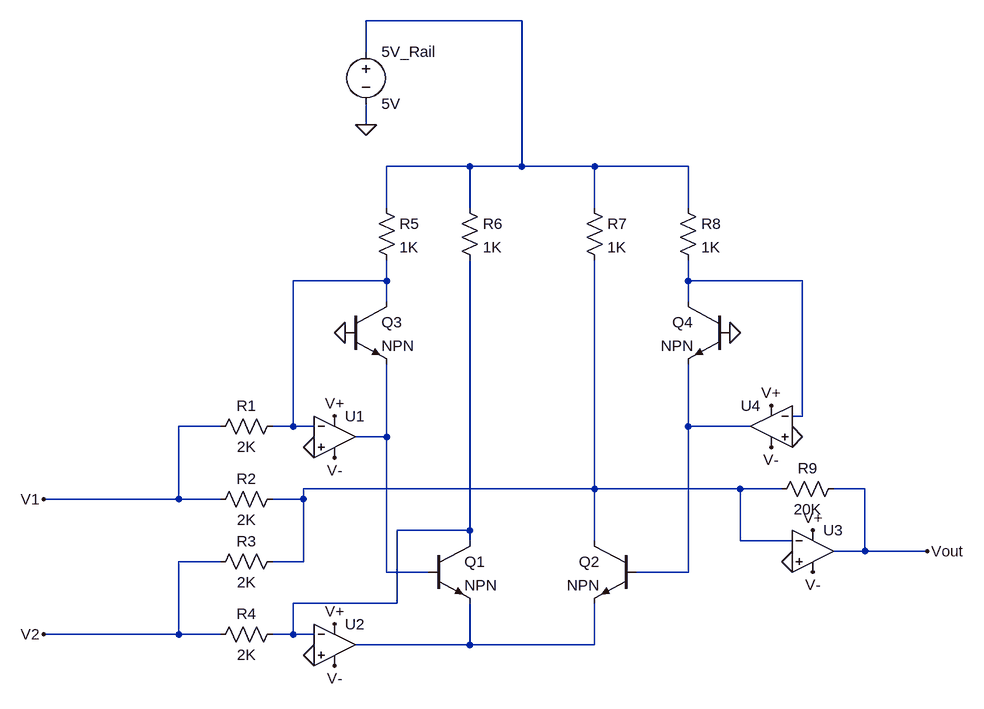
[diagram p0: schematic 4_Quadrant_Multiplier.asc]
4_Quadrant_Multiplier.asc, the LTspice schematic file:
Version 4.1
SHEET 1 1144 680
WIRE 448 -544 208 -544
WIRE 208 -496 208 -544
WIRE 208 -384 208 -416
WIRE 368 -320 240 -320
WIRE 448 -320 448 -544
WIRE 448 -320 368 -320
WIRE 560 -320 448 -320
WIRE 704 -320 560 -320
WIRE 240 -256 240 -320
WIRE 368 -256 368 -320
WIRE 560 -256 560 -320
WIRE 704 -256 704 -320
WIRE 240 -144 240 -176
WIRE 240 -144 96 -144
WIRE 704 -144 704 -176
WIRE 880 -144 704 -144
WIRE 240 -112 240 -144
WIRE 704 -112 704 -144
WIRE 880 64 880 -144
WIRE 880 64 864 64
WIRE -16 80 -80 80
WIRE 96 80 96 -144
WIRE 96 80 64 80
WIRE 128 80 96 80
WIRE 704 80 704 -16
WIRE 800 80 704 80
WIRE 240 96 240 -16
WIRE 240 96 192 96
WIRE 560 176 560 -176
WIRE 560 176 112 176
WIRE 784 176 560 176
WIRE 848 176 784 176
WIRE 976 176 928 176
WIRE -80 192 -80 80
WIRE -80 192 -288 192
WIRE -16 192 -80 192
WIRE 112 192 112 176
WIRE 112 192 64 192
WIRE 368 240 368 -176
WIRE 368 240 256 240
WIRE 368 256 368 240
WIRE 560 256 560 176
WIRE 784 256 784 176
WIRE 864 256 784 256
WIRE 976 272 976 176
WIRE 976 272 928 272
WIRE 1072 272 976 272
WIRE -16 288 -80 288
WIRE 112 288 112 192
WIRE 112 288 64 288
WIRE 240 304 240 96
WIRE 304 304 240 304
WIRE 704 304 704 80
WIRE 704 304 624 304
WIRE 256 352 256 240
WIRE 256 352 96 352
WIRE -80 400 -80 288
WIRE -80 400 -288 400
WIRE -16 400 -80 400
WIRE 96 400 96 352
WIRE 96 400 64 400
WIRE 128 400 96 400
WIRE 368 416 368 352
WIRE 368 416 192 416
WIRE 560 416 560 352
WIRE 560 416 368 416
FLAG 128 112 0
FLAG 128 432 0
FLAG 176 -64 0
FLAG 768 -64 0
FLAG 864 96 0
FLAG 864 288 0
FLAG 1072 272 Vout
FLAG -288 192 V1
FLAG -288 400 V2
FLAG 160 64 V+
FLAG 832 48 V+
FLAG 160 384 V+
FLAG 896 240 V+
FLAG 160 448 V-
FLAG 896 304 V-
FLAG 832 112 V-
FLAG 160 128 V-
FLAG 208 -384 0
SYMBOL res 80 64 R90
WINDOW 0 0 56 VBottom 2
WINDOW 3 32 56 VTop 2
SYMATTR InstName R1
SYMATTR Value 2K
SYMBOL res 80 176 R90
WINDOW 0 0 56 VBottom 2
WINDOW 3 32 56 VTop 2
SYMATTR InstName R2
SYMATTR Value 2K
SYMBOL res 80 272 R90
WINDOW 0 0 56 VBottom 2
WINDOW 3 32 56 VTop 2
SYMATTR InstName R3
SYMATTR Value 2K
SYMBOL res 80 384 R90
WINDOW 0 0 56 VBottom 2
WINDOW 3 32 56 VTop 2
SYMATTR InstName R4
SYMATTR Value 2K
SYMBOL npn 304 256 R0
SYMATTR InstName Q1
SYMBOL npn 624 256 M0
SYMATTR InstName Q2
SYMBOL npn 176 -112 R0
SYMATTR InstName Q3
SYMBOL npn 768 -112 M0
SYMATTR InstName Q4
SYMBOL res 224 -272 R0
SYMATTR InstName R5
SYMATTR Value 1K
SYMBOL res 352 -272 R0
SYMATTR InstName R6
SYMATTR Value 1K
SYMBOL res 544 -272 R0
SYMATTR InstName R7
SYMATTR Value 1K
SYMBOL res 688 -272 R0
SYMATTR InstName R8
SYMATTR Value 1K
SYMBOL res 944 160 R90
WINDOW 0 0 56 VBottom 2
WINDOW 3 32 56 VTop 2
SYMATTR InstName R9
SYMATTR Value 20K
SYMBOL OpAmps\\UniversalOpAmp 160 96 R0
SYMATTR InstName U1
SYMBOL OpAmps\\UniversalOpAmp 160 416 R0
SYMATTR InstName U2
SYMBOL OpAmps\\UniversalOpAmp 896 272 R0
SYMATTR InstName U3
SYMBOL OpAmps\\UniversalOpAmp 832 80 M0
SYMATTR InstName U4
SYMBOL voltage 208 -512 R0
WINDOW 123 0 0 Left 0
WINDOW 39 0 0 Left 0
SYMATTR InstName 5V_Rail
SYMATTR Value 5V

The netlist it stands for:
* 4_Quadrant_Multiplier.asc
R1 N002 V1 2K
R2 N006 V1 2K
R3 N006 V2 2K
R4 N007 V2 2K
Q1 N007 N005 N008 0 NPN
Q2 N006 N004 N008 0 NPN
Q3 N002 0 N005 0 NPN
Q4 N003 0 N004 0 NPN
R5 N001 N002 1K
R6 N001 N007 1K
R7 N001 N006 1K
R8 N001 N003 1K
R9 Vout N006 20K
X§U1 0 N002 V+ V- N005 level1 Avol=1Meg GBW=10Meg Vos=0 En=0 Enk=0 In=0 Ink=0 Rin=500Meg  ; pins In+ In- V+ V- OUT
X§U2 0 N007 V+ V- N008 level1 Avol=1Meg GBW=10Meg Vos=0 En=0 Enk=0 In=0 Ink=0 Rin=500Meg  ; pins In+ In- V+ V- OUT
X§U3 0 N006 V+ V- Vout level1 Avol=1Meg GBW=10Meg Vos=0 En=0 Enk=0 In=0 Ink=0 Rin=500Meg  ; pins In+ In- V+ V- OUT
X§U4 0 N003 V+ V- N004 level1 Avol=1Meg GBW=10Meg Vos=0 En=0 Enk=0 In=0 Ink=0 Rin=500Meg  ; pins In+ In- V+ V- OUT
V§5V_Rail N001 0 5V
.model NPN NPN
.model PNP PNP
.lib standard.bjt
.lib UniversalOpAmp1.lib
.backanno
.end